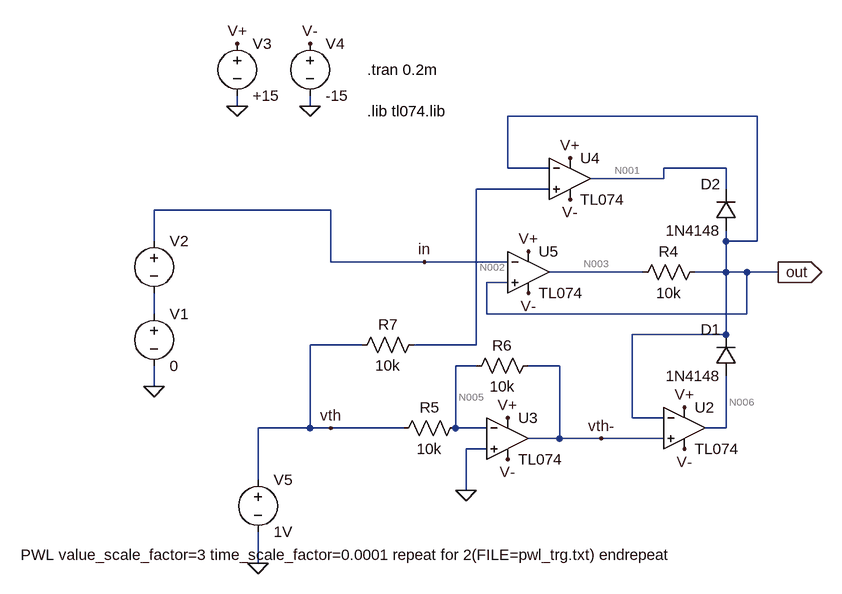
[diagram p0: schematic fig23trg3Vt1Vf10k.asc]
fig23trg3Vt1Vf10k.asc, the LTspice schematic file:
Version 4
SHEET 1 1216 680
WIRE -80 -96 -80 -112
WIRE 32 -96 32 -112
WIRE 720 -80 336 -80
WIRE 336 0 336 -80
WIRE 400 0 336 0
WIRE 672 0 576 0
WIRE 576 16 576 0
WIRE 576 16 464 16
WIRE 400 32 288 32
WIRE 672 32 672 0
WIRE 64 64 -208 64
WIRE -208 112 -208 64
WIRE 672 112 672 96
WIRE 720 112 720 -80
WIRE 720 112 672 112
WIRE 64 144 64 64
WIRE 208 144 64 144
WIRE 336 144 208 144
WIRE 544 160 400 160
WIRE 672 160 672 112
WIRE 672 160 624 160
WIRE 704 160 672 160
WIRE 752 160 704 160
WIRE 336 176 304 176
WIRE -208 224 -208 192
WIRE 304 224 304 176
WIRE 704 224 704 160
WIRE 704 224 304 224
WIRE 672 256 672 160
WIRE 672 256 528 256
WIRE 112 272 32 272
WIRE 288 272 288 32
WIRE 288 272 192 272
WIRE 288 304 256 304
WIRE 416 304 368 304
WIRE -208 336 -208 304
WIRE 528 384 528 256
WIRE 576 384 528 384
WIRE 32 400 32 272
WIRE 32 400 -48 400
WIRE 64 400 32 400
WIRE 176 400 64 400
WIRE 256 400 256 304
WIRE 304 400 256 400
WIRE 672 400 672 320
WIRE 672 400 640 400
WIRE 416 416 416 304
WIRE 416 416 368 416
WIRE 480 416 416 416
WIRE 576 416 480 416
WIRE 304 432 272 432
WIRE -48 480 -48 400
WIRE 272 496 272 432
WIRE -48 608 -48 560
FLAG -208 336 0
FLAG 272 496 0
FLAG 752 160 out
IOPIN 752 160 Out
FLAG -80 -96 0
FLAG 32 -96 0
FLAG -80 -192 V+
FLAG 32 -192 V-
FLAG 608 368 V+
FLAG 608 432 V-
FLAG -48 608 0
FLAG 208 144 in
FLAG 64 400 vth
FLAG 480 416 vth-
FLAG 336 384 V+
FLAG 368 128 V+
FLAG 432 -16 V+
FLAG 432 48 V-
FLAG 368 192 V-
FLAG 336 448 V-
SYMBOL res 528 176 R270
WINDOW 0 32 56 VTop 0
WINDOW 3 0 56 VBottom 0
SYMATTR InstName R4
SYMATTR Value 10k
SYMBOL voltage -208 96 R0
WINDOW 3 -205 499 Left 0
SYMATTR Value PWL value_scale_factor=3 time_scale_factor=0.0001 repeat for 2(FILE=pwl_trg.txt) endrepeat
SYMATTR InstName V2
SYMBOL diode 688 320 R180
WINDOW 0 24 72 Left 0
WINDOW 3 24 0 Left 0
SYMATTR InstName D1
SYMATTR Value 1N4148
SYMBOL voltage -80 -208 R0
SYMATTR InstName V3
SYMATTR Value +15
SYMBOL voltage 32 -208 R0
SYMATTR InstName V4
SYMATTR Value -15
SYMBOL Opamps\\opamp2 608 336 R0
SYMATTR InstName U2
SYMATTR Value TL074
SYMBOL voltage -48 464 R0
WINDOW 123 0 0 Left 0
WINDOW 39 0 0 Left 0
SYMATTR InstName V5
SYMATTR Value 1V
SYMBOL Opamps\\opamp2 336 352 R0
SYMATTR InstName U3
SYMATTR Value TL074
SYMBOL Opamps\\opamp2 432 -48 R0
SYMATTR InstName U4
SYMATTR Value TL074
SYMBOL Opamps\\opamp2 368 96 R0
SYMATTR InstName U5
SYMATTR Value TL074
SYMBOL res 160 416 R270
WINDOW 0 32 56 VTop 0
WINDOW 3 0 56 VBottom 0
SYMATTR InstName R5
SYMATTR Value 10k
SYMBOL res 272 320 R270
WINDOW 0 32 56 VTop 0
WINDOW 3 0 56 VBottom 0
SYMATTR InstName R6
SYMATTR Value 10k
SYMBOL res 96 288 R270
WINDOW 0 32 56 VTop 0
WINDOW 3 0 56 VBottom 0
SYMATTR InstName R7
SYMATTR Value 10k
SYMBOL diode 688 96 R180
WINDOW 0 24 72 Left 0
WINDOW 3 24 0 Left 0
SYMATTR InstName D2
SYMATTR Value 1N4148
SYMBOL voltage -208 208 R0
WINDOW 123 0 0 Left 0
WINDOW 39 0 0 Left 0
SYMATTR InstName V1
SYMATTR Value 0
TEXT 120 -88 Left 0 !.lib tl074.lib
TEXT 120 -152 Left 0 !.tran 0.2m

The netlist it stands for:
* fig23trg3Vt1Vf10k.asc
R4 N003 out 10k
V2 in N004 PWL value_scale_factor=3 time_scale_factor=0.0001 repeat for 2(FILE=pwl_trg.txt) endrepeat
D1 N006 out 1N4148
V3 V+ 0 +15
V4 V- 0 -15
XU2 vth- out V+ V- N006 TL074  ; pins In+ In- V+ V- OUT
V5 vth 0 1V
XU3 0 N005 V+ V- vth- TL074  ; pins In+ In- V+ V- OUT
XU4 N002 out V+ V- N001 TL074  ; pins In+ In- V+ V- OUT
XU5 out in V+ V- N003 TL074  ; pins In+ In- V+ V- OUT
R5 vth N005 10k
R6 N005 vth- 10k
R7 vth N002 10k
D2 out N001 1N4148
V1 N004 0 0
.model D D
.lib standard.dio
.lib tl074.lib
.tran 0.2m
.backanno
.end

* Results of the author's LTspice run, read from the files saved beside the schematic
* Operating Point, zero values left out:
*   V(n003) = -9.615 µV
*   V(out) = -10.97 µV
*   V(n006) = -13.48 V
*   V(v+) = 15 V
*   V(v-) = -15 V
*   V(vth-) = -1 V
*   V(vth) = 1 V
*   V(n005) = 15.46 µV
*   V(n001) = 13.48 V
*   V(n002) = 1 V
*   I(D2) = -2.533 nA
*   I(D1) = -2.533 nA
*   I(R7) = 47.15 pA
*   I(R6) = 100 µA
*   I(R5) = 100 µA
*   I(R4) = 135.6 pA
*   I(V1) = -45.05 pA
*   I(V5) = -100 µA
*   I(V4) = 56.59 mA
*   I(V3) = -56.59 mA
*   I(V2) = -45.05 pA
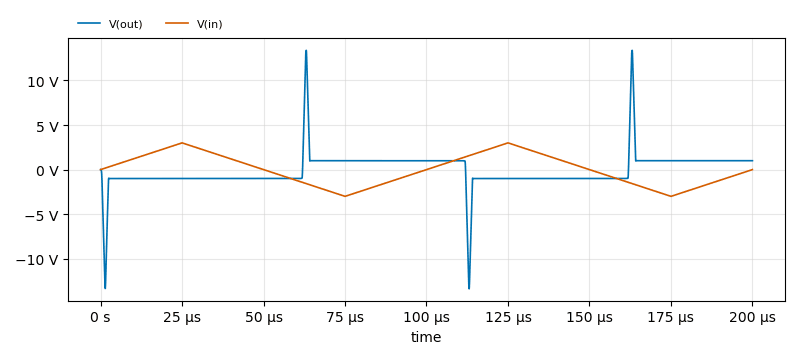
[diagram p1: Transient Analysis of fig23trg3Vt1Vf10k.asc, plotted from the saved traces]
* Transient Analysis, 1 run:
*   V(out): min -13.36 V, max 13.37 V, average -109.1 mV, rms 2.004 V, last 1 V
*   V(in): min -3 V, max 3 V, average 0 V, rms 1.886 V, last 0 V